# Altium schematic sheet Power_12V.SchDoc
size B
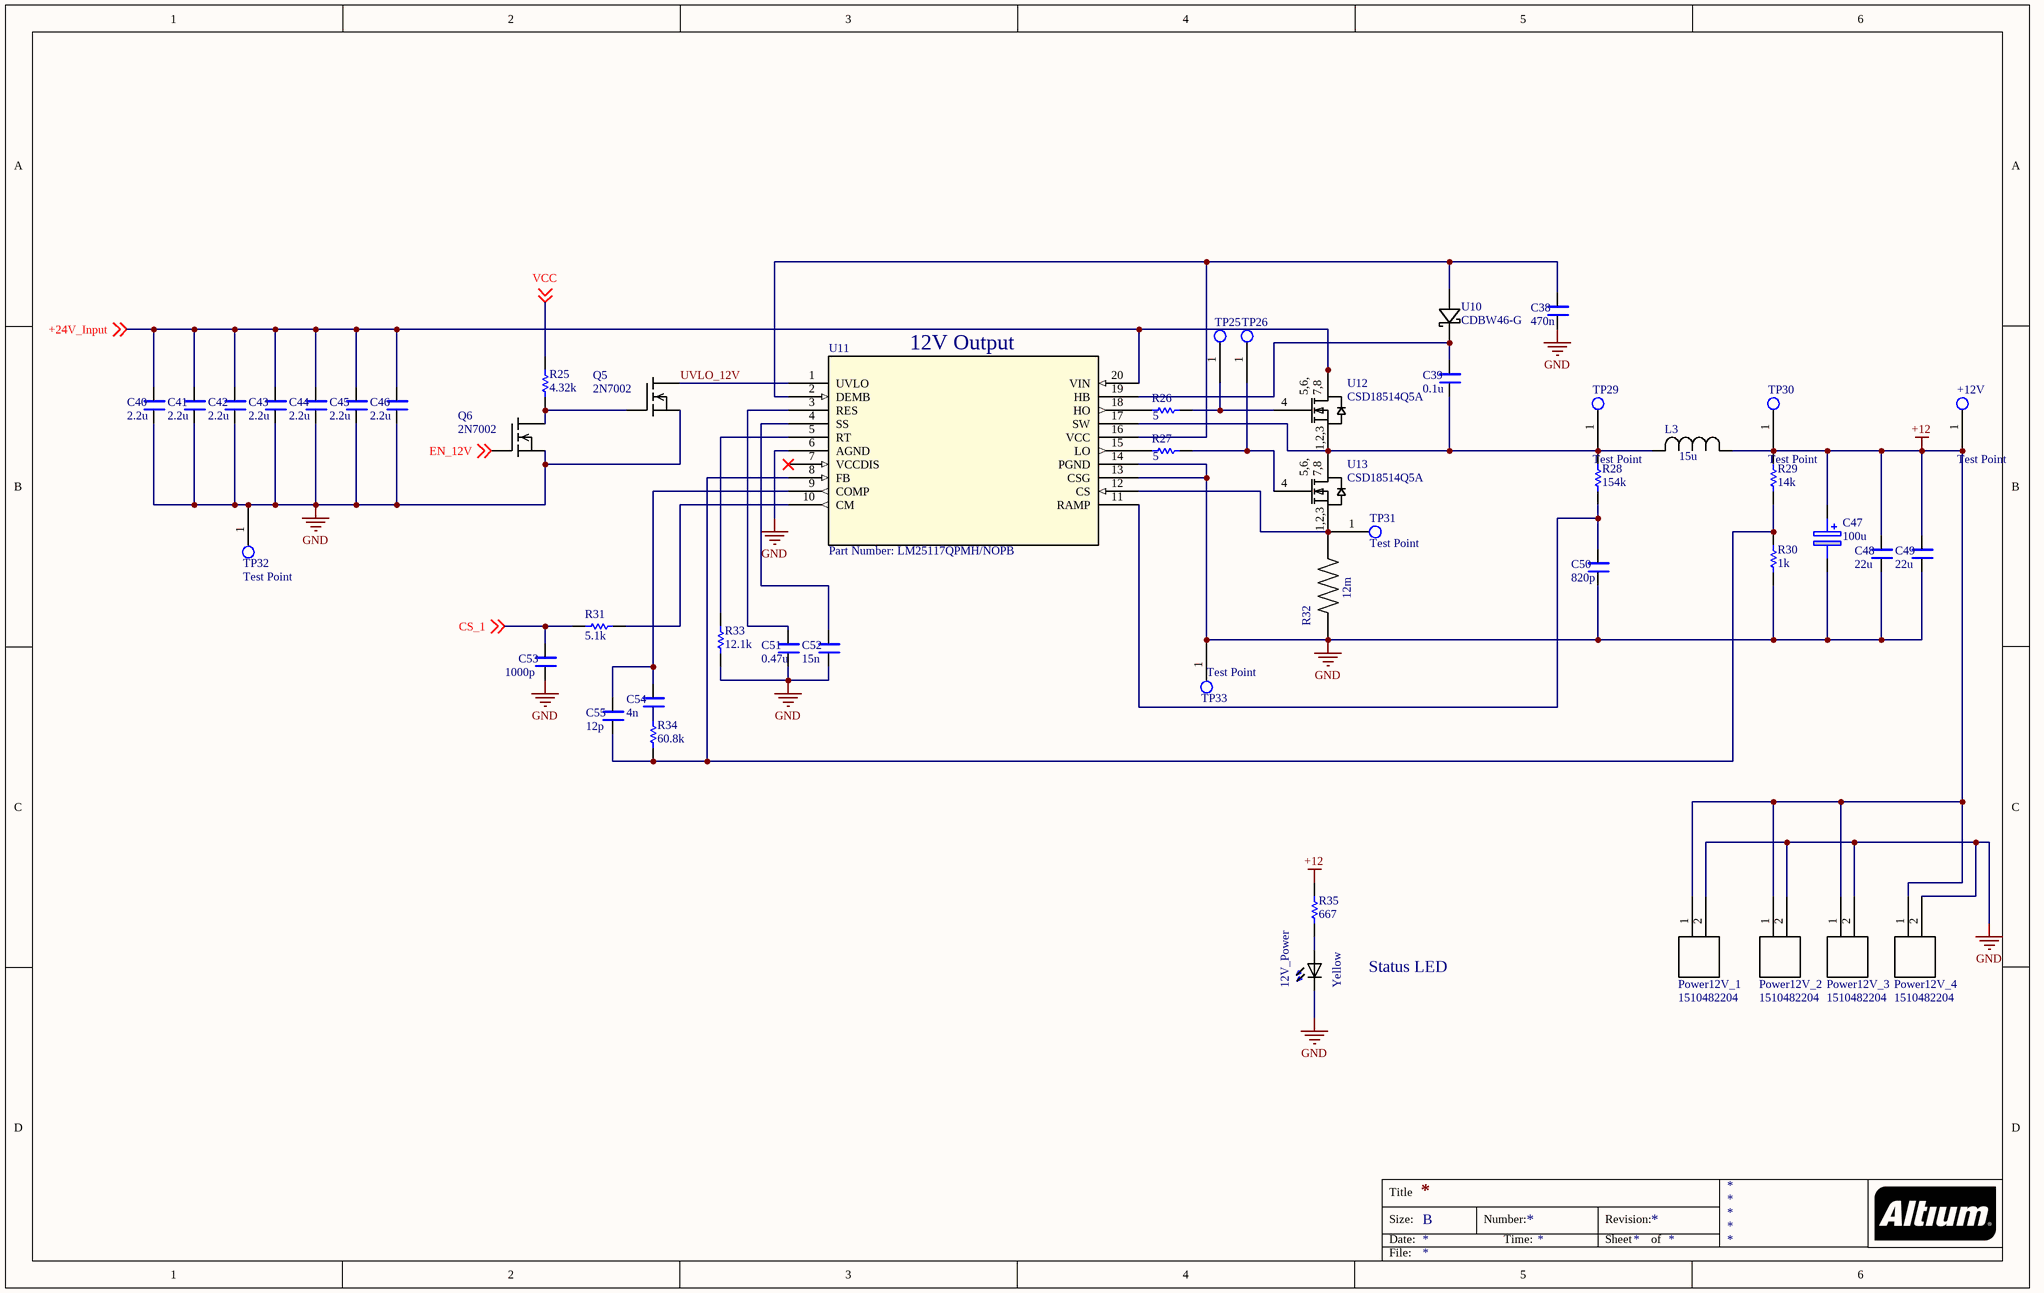
[diagram p0: Power_12V.SchDoc]

## Parts
12V_Power  Yellow  [*DIOC200X125X110_LTST-C171KSKT(Primary)]
+12V  Test Point  [Test Point Through-hole]
C38  470n  [*CAPC2012X88N]
C39  0.1u  [*CAPC2012X88N]
C40  2.2u  [*CAPC2012X88N]
C41  2.2u  [*CAPC2012X88N]
C42  2.2u  [*CAPC2012X88N]
C43  2.2u  [*CAPC2012X88N]
C44  2.2u  [*CAPC2012X88N]
C45  2.2u  [*CAPC2012X88N]
C46  2.2u  [*CAPC2012X88N]
C47  100u  [CAPPRD500W65D1000H1800]
C48  22u  [*CAPC2012X88N]
C49  22u  [*CAPC2012X88N]
C50  820p  [*CAPC2012X88N]
C51  0.47u  [*CAPC2012X88N]
C52  15n  [*CAPC2012X88N]
C53  1000p  [*CAPC2012X88N]
C54  4n  [*CAPC2012X88N]
C55  12p  [*CAPC2012X88N]
L3  15u  [IND_BOURNS_SRP12]
Power12V_1  1510482204  [1510482204]
Power12V_2  1510482204  [1510482204]
Power12V_3  1510482204  [1510482204]
Power12V_4  1510482204  [1510482204]
Q5  2N7002  [*SOT23]
Q6  2N7002  [*SOT23]
R25  4.32k  [RESC0805(2012)_M]
R26  5  [AXIAL-0.3]
R27  5  [AXIAL-0.3]
R28  154k  [RESC0805(2012)_M]
R29  14k  [RESC0805(2012)_M]
R30  1k  [RESC0805(2012)_M]
R31  5.1k  [RESC0805(2012)_M]
R32  12m  [*RESC6432X110N]
R33  12.1k  [RESC0805(2012)_M]
R34  60.8k  [RESC0805(2012)_M]
R35  667  [RESC0805(2012)_M]
TP25  (no value)  [Test Point Through-hole]
TP26  (no value)  [Test Point Through-hole]
TP29  Test Point  [Test Point Through-hole]
TP30  Test Point  [Test Point Through-hole]
TP31  Test Point  [Test Point Through-hole]
TP32  Test Point  [Test Point Through-hole]
TP33  Test Point  [Test Point Through-hole]
U10  CDBW46-G  [CDBW]
U11  Part Number: LM25117QPMH/NOPB  [MXA20A]
U12  CSD18514Q5A  [DQJ0008A]
U13  CSD18514Q5A  [DQJ0008A]

## Nets
+12: +12V.1 C47.1(+) C48.2 C49.2 L3.1 Power12V_1.1 Power12V_2.1 Power12V_3.1 Power12V_4.1 R29.2 R35.2 TP30.1
GND: 12V_Power.NEG C38.1 C40.1 C41.1 C42.1 C43.1 C44.1 C45.1 C46.1 C47.2(-) C48.1 C49.1 C50.1 C51.1 C52.1 C53.1 Power12V_1.2 Power12V_2.2 Power12V_3.2 Power12V_4.2 Q5.2(S) Q6.2(S) R30.1 R32.1 R33.1 TP32.1 TP33.1 U11.6(AGND) U11.13(CSG) U11.14(PGND)
+24V_Input: C40.2 C41.2 C42.2 C43.2 C44.2 C45.2 C46.2 U11.20(VIN) U12.5(D) U12.6(D) U12.7(D) U12.8(D) ; off-sheet +24V_Input
CS_1: C53.2 R31.2 ; off-sheet CS_1
EN_12V: Q6.1(G) ; off-sheet EN_12V
UVLO_12V: Q5.3(D) U11.1(UVLO)
VCC: R25.2 ; off-sheet VCC
Net12V_Power_POS: 12V_Power.POS R35.1
NetC38_2: C38.2 U10.2 U11.2(DEMB) U11.16(VCC)
NetC39_1: C39.1 L3.2 R28.2 TP29.1 U11.17(SW) U12.1(S) U12.2(S) U12.3(S) U13.5(D) U13.6(D) U13.7(D) U13.8(D)
NetC39_2: C39.2 U10.1 U11.19(HB)
NetC50_2: C50.2 R28.1 U11.11(RAMP)
NetC51_2: C51.2 U11.3(RES)
NetC52_2: C52.2 U11.4(SS)
NetC54_1: C54.1 R34.2
NetC54_2: C54.2 C55.2 U11.9(COMP)
NetC55_1: C55.1 R29.1 R30.2 R34.1 U11.8(FB)
NetQ5_1: Q5.1(G) Q6.3(D) R25.1
NetR26_1: R26.1 U11.18(HO)
NetR26_2: R26.2 TP25.1 U12.4(G)
NetR27_1: R27.1 U11.15(LO)
NetR27_2: R27.2 TP26.1 U13.4(G)
NetR31_1: R31.1 U11.10(CM)
NetR32_2: R32.2 TP31.1 U11.12(CS) U13.1(S) U13.2(S) U13.3(S)
NetR33_2: R33.2 U11.5(RT)

Not connected (* = marked no-connect by the designer): U11 7(VCCDIS)*

## Notes on the sheet
- (near U11) 12V Output
- Status LED
- Title
- Size:
- Date:
- B
- Number:
- Time:
- Revision:
- Sheet
- of
- File:
- (in symbol CSD18514Q5A) 5,6,; 7,8; 1,2,3

## Library data of the parts
12V_Power = LTST-C171KSKT: / Yellow 2 x 1.25 x 0.8 mm 130Â° Water Clear 50 mcd 2 V LED SMT /; MF: Lite-On Inc.; SnapEDA_Link: https://www.snapeda.com/parts/LTST-C171KSKT/Lite-On%20Inc./view-part/?ref=snap; Package: 0805 Lite-On; MP: LTST-C171KSKT; Digi-Key_Part_Number: 160-1428-1-ND; Digi-Key_Purchase_URL: https://www.digikey.com/product-detail/en/lite-on-inc/LTST-C171KSKT/160-1428-1-ND/386802?utm_source=snapeda&utm_medium=aggregator&utm_campaign=symbol; Value: *
C38-C46 C48-C55 = C0805C101JAGAC7800: / 100pF Â±5% 250V Ceramic Capacitor C0G, NP0 0805 _2012 Metric_ /; MF: KEMET; Package: 0805 KEMET; Digi-Key_Part_Number: 399-15000-1-ND; MP: C0805C101JAGAC7800; Digi-Key_Purchase_URL: https://www.digikey.com/product-detail/en/kemet/C0805C101JAGAC7800/399-15000-1-ND/7382549?utm_source=snapeda&utm_medium=aggregator&utm_campaign=symbol; SnapEDA_Link: https://www.snapeda.com/parts/C0805C101JAGAC7800/KEMET/view-part/3661430/?ref=snap; Value: *
C47 = EEUFC1V331: FC radial elec cap,330uF 35V Panasonic Aluminium Electrolytic Capacitor 330F 35 V dc 10mm Through Hole series FC Radial lifetime 3000h; Allied_Number: 70068521; Geometry.Height: 18mm; Manufacturer_Name: Panasonic; Manufacturer_Part_Number: EEUFC1V331; RS Part Number: 1081337; RS Price/Stock: http://uk.rs-online.com/web/p/products/1081337; Allied Price/Stock: https://www.alliedelec.com/panasonic-eeufc1v331/70068521/; Mouser Part Number: 1081337; Mouser Price/Stock: http://uk.rs-online.com/web/p/products/1081337; Datasheet Link: https://industrial.panasonic.com/cdbs/www-data/pdf/RDF0000/ABA0000C1209.pdf
L3 = Inductor-6.8uH: No Description Available; Manufacturer_Part_Number: SRP1270-6R8M; Vendor: Bourns Electronics; Built_By: EMA_UL_Team; Type: DEV; Copyright: Copyright (C) 2018 Accelerated Designs. All rights reserved; RefDes: RefDes; Value: Value
Power12V_1-Power12V_4 = 1510482204: Molex 6.5MM 2 pin connector, used for power connections. P/N 1510482204 and similar models.
Q5 Q6 = 2N7002: Trans MOSFET N-CH 60V 0.115A 3-Pin SOT-23 T/R; MF: ON Semiconductor; Price: None; SnapEDA_Link: https://www.snapeda.com/parts/2N7002/ON%20Semiconductor/view-part/4449003/?ref=snap; Availability: Unavailable; Package: SOT-23-3 ON Semiconductor; MP: 2N7002; Value: *
R25 R28-R31 R33-R35 = CMP-1013-00951-1: 8M06 0.125W 1% 0805 (2012 Metric)  SMD; Value: 8060000.00 Ohm; Case-EIA: 0805; Case-Metric: 2012; Power: 0.125 W; Technology: SMT; Tolerance: 1 %
R26 R27 = 120R 5% 0805: 120R 0.125W 5% 0805 (2012 Metric)  SMD; Case-Metric: 2012; Value: 120.00 Ohm; Case-EIA: 0805; Tolerance: 5 %; Technology: SMT; Power: 0.125 W
R32 = ERJ-M1WSF12MU: Res Thick Film 2512 0.012 Ohm 1% 1W Pad SMD Automotive T/R; MF: Panasonic; MP: ERJ-M1WSF12MU; Package: 6432 Panasonic Electronic Components; Digi-Key_Purchase_URL: https://www.digikey.com/product-detail/en/panasonic-electronic-components/ERJ-M1WSF12MU/P12MCT-ND/300474?utm_source=snapeda&utm_medium=aggregator&utm_campaign=symbol; Digi-Key_Part_Number: P12MCT-ND; SnapEDA_Link: https://www.snapeda.com/parts/ERJ-M1WSF12MU/Panasonic/view-part/?ref=snap; Value: *
TP25 TP26 = Test Point
U10 = CDBW46-G: No Description Available; Vendor: Comchip; Built_By: EMA_UL_Team; Manufacturer_Part_Number: CDBW46-G; Copyright: Copyright (C) 2018 Accelerated Designs. All rights reserved; RefDes: RefDes; Type: DEV; Value: Value
U11 = LM25117QPMH/NOPB: No Description Available; Manufacturer: Texas Instruments; Built_By: EMA_UL_Team; Manufacturer_Part_Number: LM25117QPMH/NOPB; Vendor: Texas Instruments; Copyright: Copyright (C) 2018 Accelerated Designs. All rights reserved; RefDes: RefDes; Type: DEV; Value: Value
U12 U13 = CSD18514Q5A: No Description Available; Vendor: Texas Instruments; Built_By: Texas_Instrument_Team; Value: 40V; VALUE_2: Value; Manufacturer_Part_Number: CSD18514Q5A; Copyright: Copyright (C) 2018 Accelerated Designs. All rights reserved; RefDes: RefDes; Type: DEV